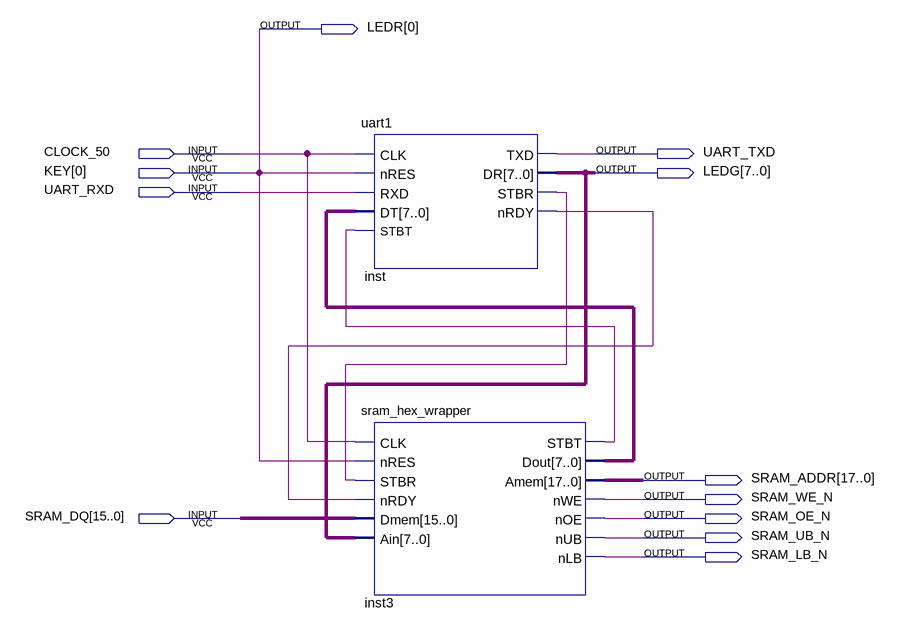
[diagram p0: schematic sheet]
// Quartus schematic rs232ex1.bdf as structural Verilog: 2 symbols, 12 pins
module rs232ex1 (
  input  CLOCK_50,
  input  [0:0] KEY,
  input  UART_RXD,
  input  [15:0] SRAM_DQ,
  output [0:0] LEDR,
  output UART_TXD,
  output [7:0] LEDG,
  output [17:0] SRAM_ADDR,
  output SRAM_WE_N,
  output SRAM_OE_N,
  output SRAM_UB_N,
  output SRAM_LB_N
);

  wire inst3_stbt, inst_nrdy, inst_stbr;
  wire [7:0] inst3_dout;

  uart1 inst (
    .CLK(CLOCK_50), .nRES(KEY[0]), .RXD(UART_RXD), .DT(inst3_dout), .STBT(inst3_stbt), .TXD(UART_TXD),
    .DR(LEDG), .STBR(inst_stbr), .nRDY(inst_nrdy));
  sram_hex_wrapper inst3 (
    .CLK(CLOCK_50), .nRES(KEY[0]), .STBR(inst_stbr), .nRDY(inst_nrdy), .Dmem(SRAM_DQ), .Ain(LEDG),
    .STBT(inst3_stbt), .Dout(inst3_dout), .Amem(SRAM_ADDR), .nWE(SRAM_WE_N), .nOE(SRAM_OE_N),
    .nUB(SRAM_UB_N), .nLB(SRAM_LB_N));

  assign LEDR[0] = KEY[0];
endmodule
